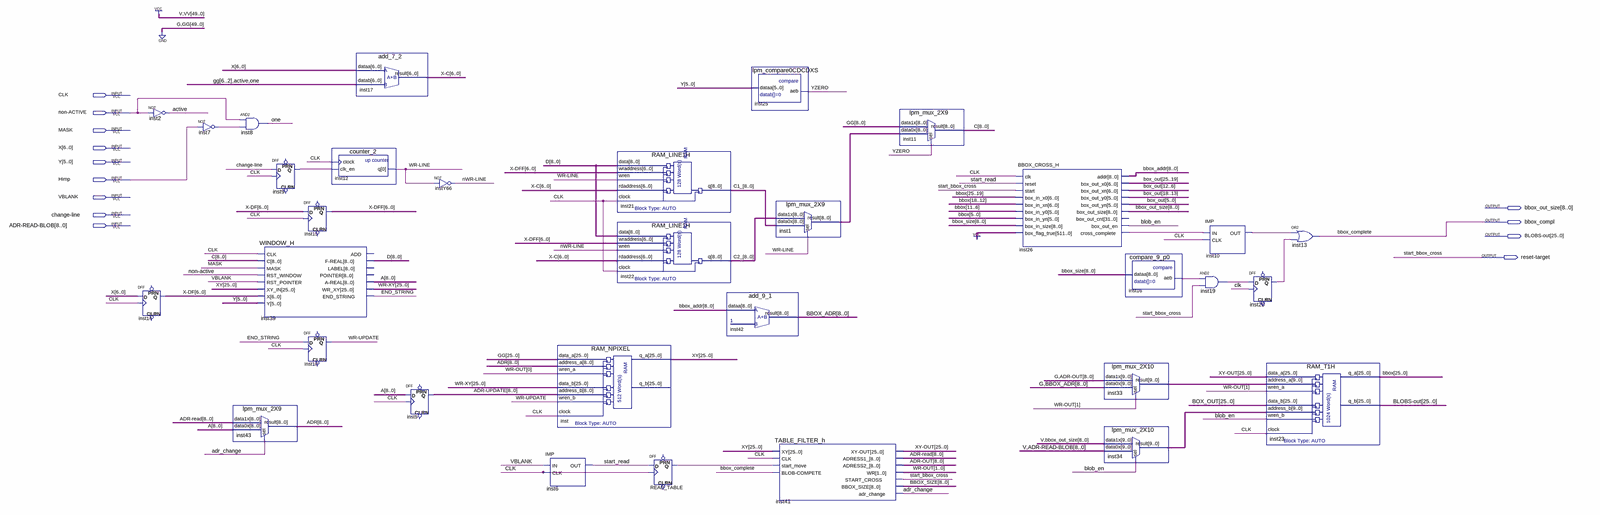
[diagram p0: schematic sheet, whole]
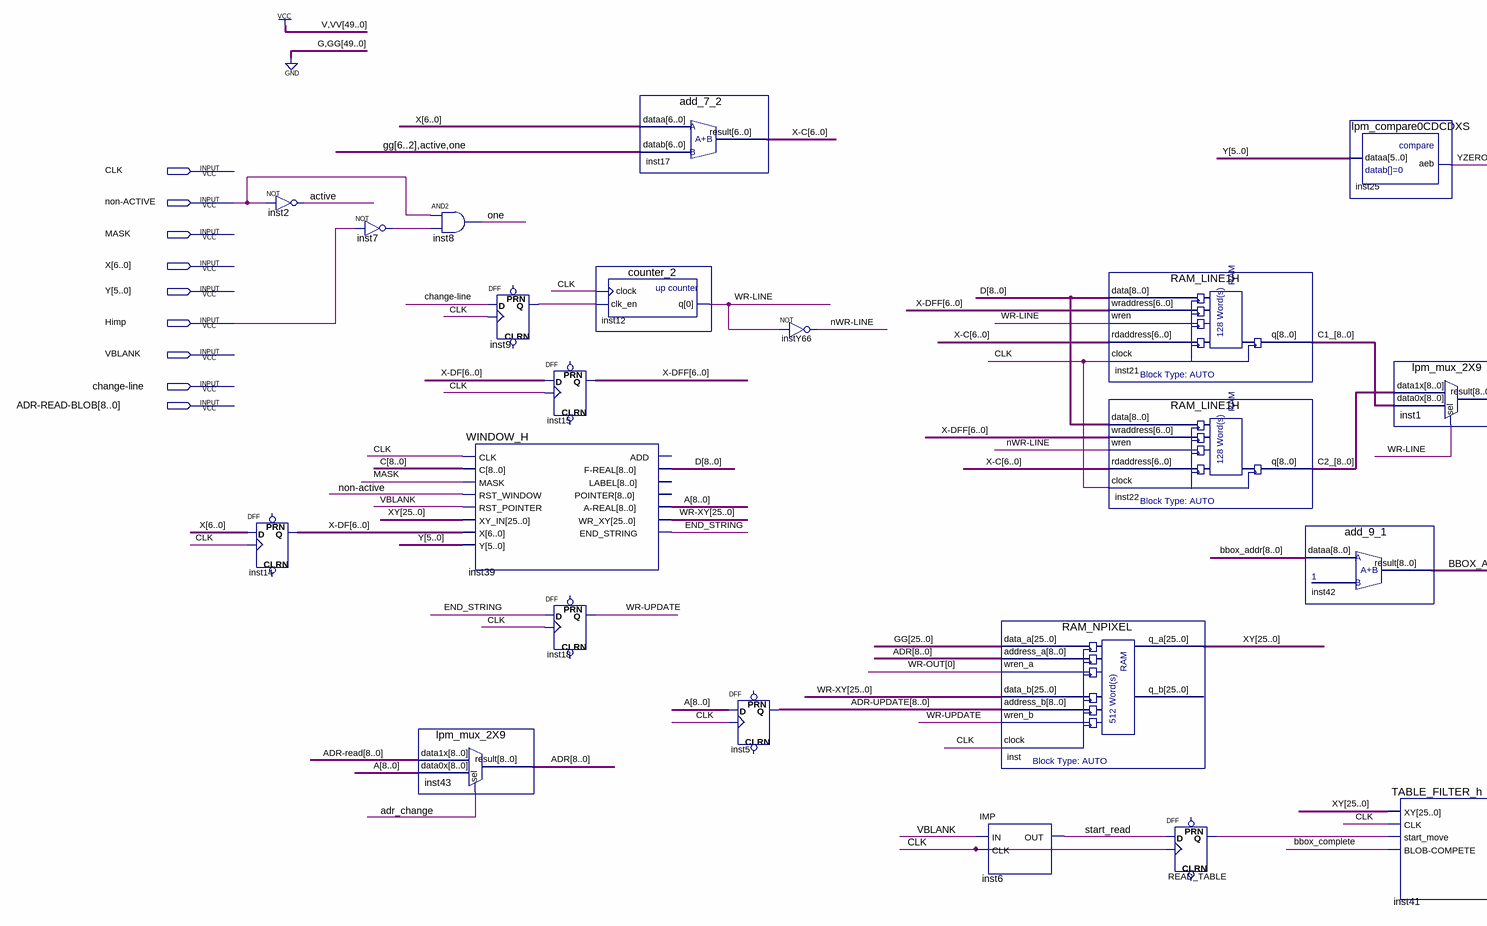
[diagram p1: schematic sheet, left part]
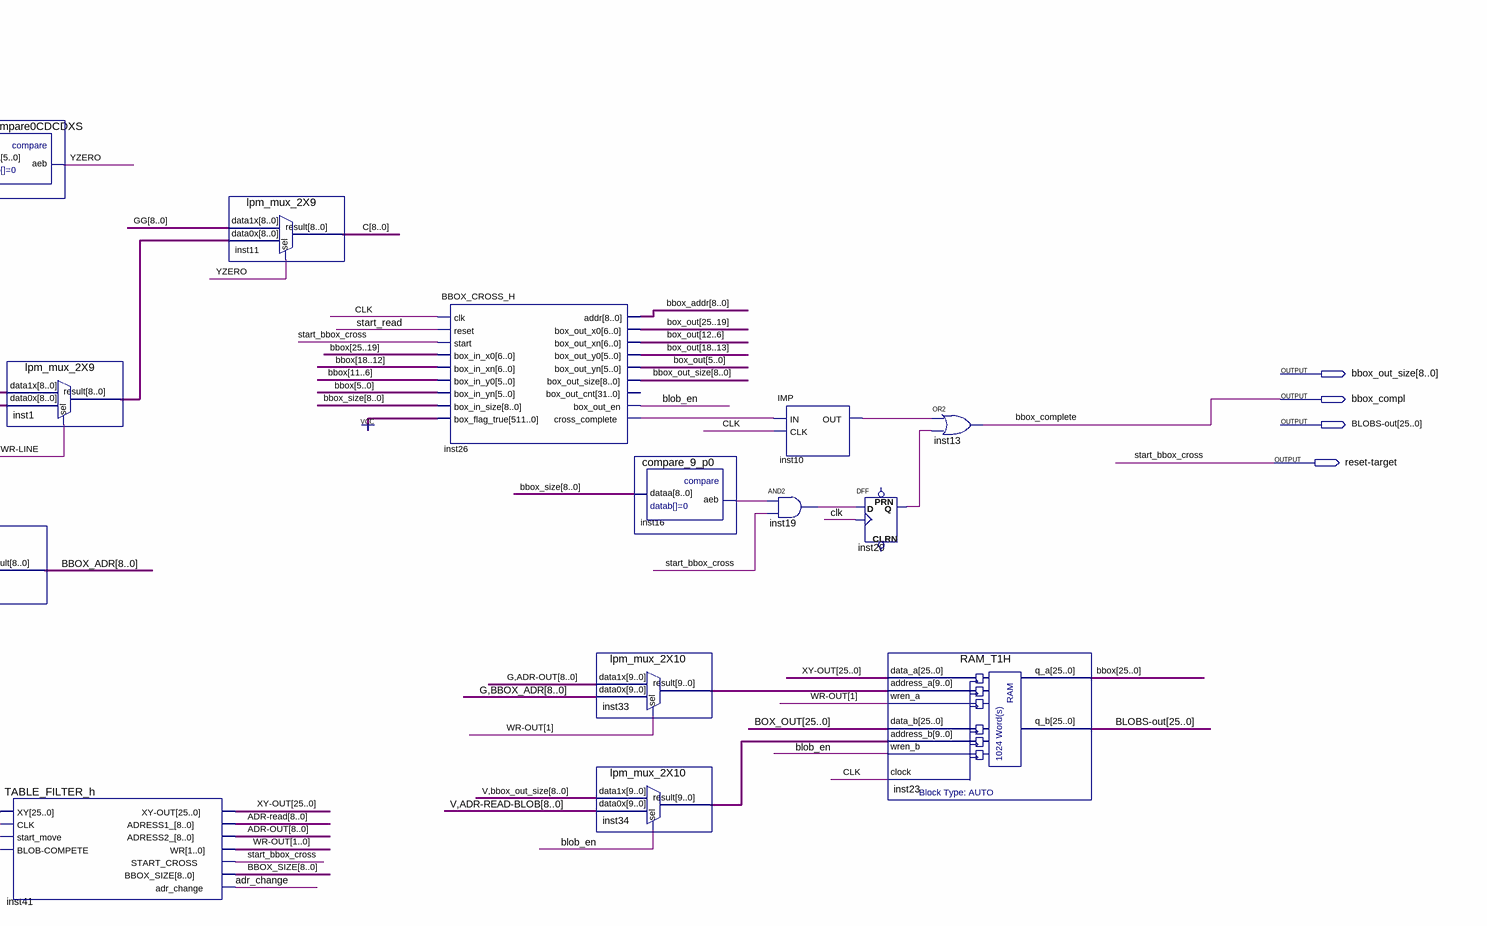
[diagram p2: schematic sheet, right part]
// Quartus schematic HTPA-BLOB_stable.bdf as structural Verilog: 32 symbols, 13 pins
module \HTPA-BLOB_stable  (
  input  CLK,
  input  \non-ACTIVE ,
  input  MASK,
  input  [6:0] X,
  input  [5:0] Y,
  input  Himp,
  input  VBLANK,
  input  \change-line ,
  input  [8:0] \ADR-READ-BLOB ,
  output [8:0] bbox_out_size,
  output bbox_compl,
  output [25:0] \BLOBS-out ,
  output \reset-target 
);

  wire active, adr_change, blob_en, END_STRING, inst7_out, inst9_q, inst10_out, inst16_aeb, inst19_out,
       inst20_q, inst26_cross_complete, \nWR-LINE , one, READ_TABLE_q, start_read, \WR-LINE , \WR-UPDATE ,
       YZERO;
  wire [1:0] \WR-OUT ;
  wire [6:0] \X-C , \X-DF , \X-DFF ;
  wire [8:0] A, ADR, \ADR-OUT , \ADR-read , \ADR-UPDATE , bbox_addr, BBOX_ADR, bbox_size, C, C1_, C2_, D,
       inst1_result;
  wire [9:0] inst33_result, inst34_result;
  wire [25:0] bbox, BOX_OUT, \WR-XY , XY, \XY-OUT ;

  not inst2 (active, \non-ACTIVE );
  DFF inst14[6:0] (.CLK(CLK), .D(X), .Q(\X-DF ));  // open: CLRN, PRN
  not inst7 (inst7_out, Himp);
  and inst8 (one, \non-ACTIVE , inst7_out);
  lpm_mux_2X9 inst43 (.data1x(\ADR-read ), .data0x(A), .sel(adr_change), .result(ADR));
  WINDOW_H inst39 (
    .CLK(CLK), .C(C), .MASK(MASK), .RST_WINDOW(\non-ACTIVE ), .RST_POINTER(VBLANK), .XY_IN(XY), .X(\X-DF ),
    .Y(Y), .\F-REAL (D), .\A-REAL (A), .WR_XY(\WR-XY ), .END_STRING(END_STRING));  // open: ADD, LABEL, POINTER
  DFF inst9 (.CLK(CLK), .D(\change-line ), .Q(inst9_q));  // open: CLRN, PRN
  DFF inst15[6:0] (.CLK(CLK), .D(\X-DF ), .Q(\X-DFF ));  // open: CLRN, PRN
  DFF inst18 (.CLK(CLK), .D(END_STRING), .Q(\WR-UPDATE ));  // open: CLRN, PRN
  counter_2 inst12 (.clock(CLK), .clk_en(inst9_q), .q(\WR-LINE ));
  add_7_2 inst17 (.dataa(X), .datab({{5{1'b0}}, active, one}), .result(\X-C ));
  DFF inst5[8:0] (.CLK(CLK), .D(A), .Q(\ADR-UPDATE ));  // open: CLRN, PRN
  not instY66 (\nWR-LINE , \WR-LINE );
  IMP inst6 (.IN(VBLANK), .CLK(CLK), .OUT(start_read));
  RAM_NPIXEL inst (
    .data_a({26{1'b0}}), .address_a(ADR), .wren_a(\WR-OUT [0]), .data_b(\WR-XY ), .address_b(\ADR-UPDATE ),
    .wren_b(\WR-UPDATE ), .clock(CLK), .q_a(XY));  // open: q_b
  RAM_LINE1H inst21 (.data(D), .wraddress(\X-DFF ), .wren(\WR-LINE ), .rdaddress(\X-C ), .clock(CLK), .q(C1_));
  RAM_LINE1H inst22 (.data(D), .wraddress(\X-DFF ), .wren(\nWR-LINE ), .rdaddress(\X-C ), .clock(CLK), .q(C2_));
  DFF READ_TABLE (.CLK(CLK), .D(start_read), .Q(READ_TABLE_q));  // open: CLRN, PRN
  add_9_1 inst42 (.dataa(bbox_addr), .result(BBOX_ADR));
  lpm_compare0CDCDXS inst25 (.dataa(Y), .aeb(YZERO));
  lpm_mux_2X9 inst1 (.data1x(C2_), .data0x(C1_), .sel(\WR-LINE ), .result(inst1_result));
  TABLE_FILTER_h inst41 (
    .XY(XY), .CLK(CLK), .start_move(READ_TABLE_q), .\BLOB-COMPETE (bbox_compl), .\XY-OUT (\XY-OUT ),
    .ADRESS1_(\ADR-read ), .ADRESS2_(\ADR-OUT ), .WR(\WR-OUT ), .START_CROSS(\reset-target ),
    .BBOX_SIZE(bbox_size), .adr_change(adr_change));
  lpm_mux_2X9 inst11 (.data1x({9{1'b0}}), .data0x(inst1_result), .sel(YZERO), .result(C));
  BBOX_CROSS_H inst26 (
    .clk(CLK), .reset(start_read), .start(\reset-target ), .box_in_x0(bbox[25:19]), .box_in_xn(bbox[18:12]),
    .box_in_y0(bbox[11:6]), .box_in_yn(bbox[5:0]), .box_in_size(bbox_size), .box_flag_true({512{1'b1}}),
    .addr(bbox_addr), .box_out_x0(BOX_OUT[25:19]), .box_out_xn(BOX_OUT[12:6]), .box_out_y0(BOX_OUT[18:13]),
    .box_out_yn(BOX_OUT[5:0]), .box_out_size(bbox_out_size), .box_out_en(blob_en),
    .cross_complete(inst26_cross_complete));  // open: box_out_cnt
  lpm_mux_2X10 inst33 (
    .data1x({1'b0, \ADR-OUT }), .data0x({1'b0, BBOX_ADR}), .sel(\WR-OUT [1]), .result(inst33_result));
  lpm_mux_2X10 inst34 (
    .data1x({1'b1, bbox_out_size}), .data0x({1'b1, \ADR-READ-BLOB }), .sel(blob_en), .result(inst34_result));
  compare_9_p0 inst16 (.dataa(bbox_size), .aeb(inst16_aeb));
  and inst19 (inst19_out, inst16_aeb, \reset-target );
  IMP inst10 (.IN(inst26_cross_complete), .CLK(CLK), .OUT(inst10_out));
  DFF inst20 (.CLK(CLK), .D(inst19_out), .Q(inst20_q));  // open: CLRN, PRN
  RAM_T1H inst23 (
    .data_a(\XY-OUT ), .address_a(inst33_result), .wren_a(\WR-OUT [1]), .data_b(BOX_OUT),
    .address_b(inst34_result), .wren_b(blob_en), .clock(CLK), .q_a(bbox), .q_b(\BLOBS-out ));
  or inst13 (bbox_compl, inst10_out, inst20_q);

  // Other names for the same wires on the sheet: bbox_complete = bbox_compl; start_bbox_cross = \reset-target 
endmodule
